# EasyEDA schematic 1-Schematic_Attyni13 EvaBoard.json
TITLE: Attiny13 Prototiping board; REV: 1.3; Date: 2023-11-29; Sheet: 1/1; Company: Lucian Semiconductors
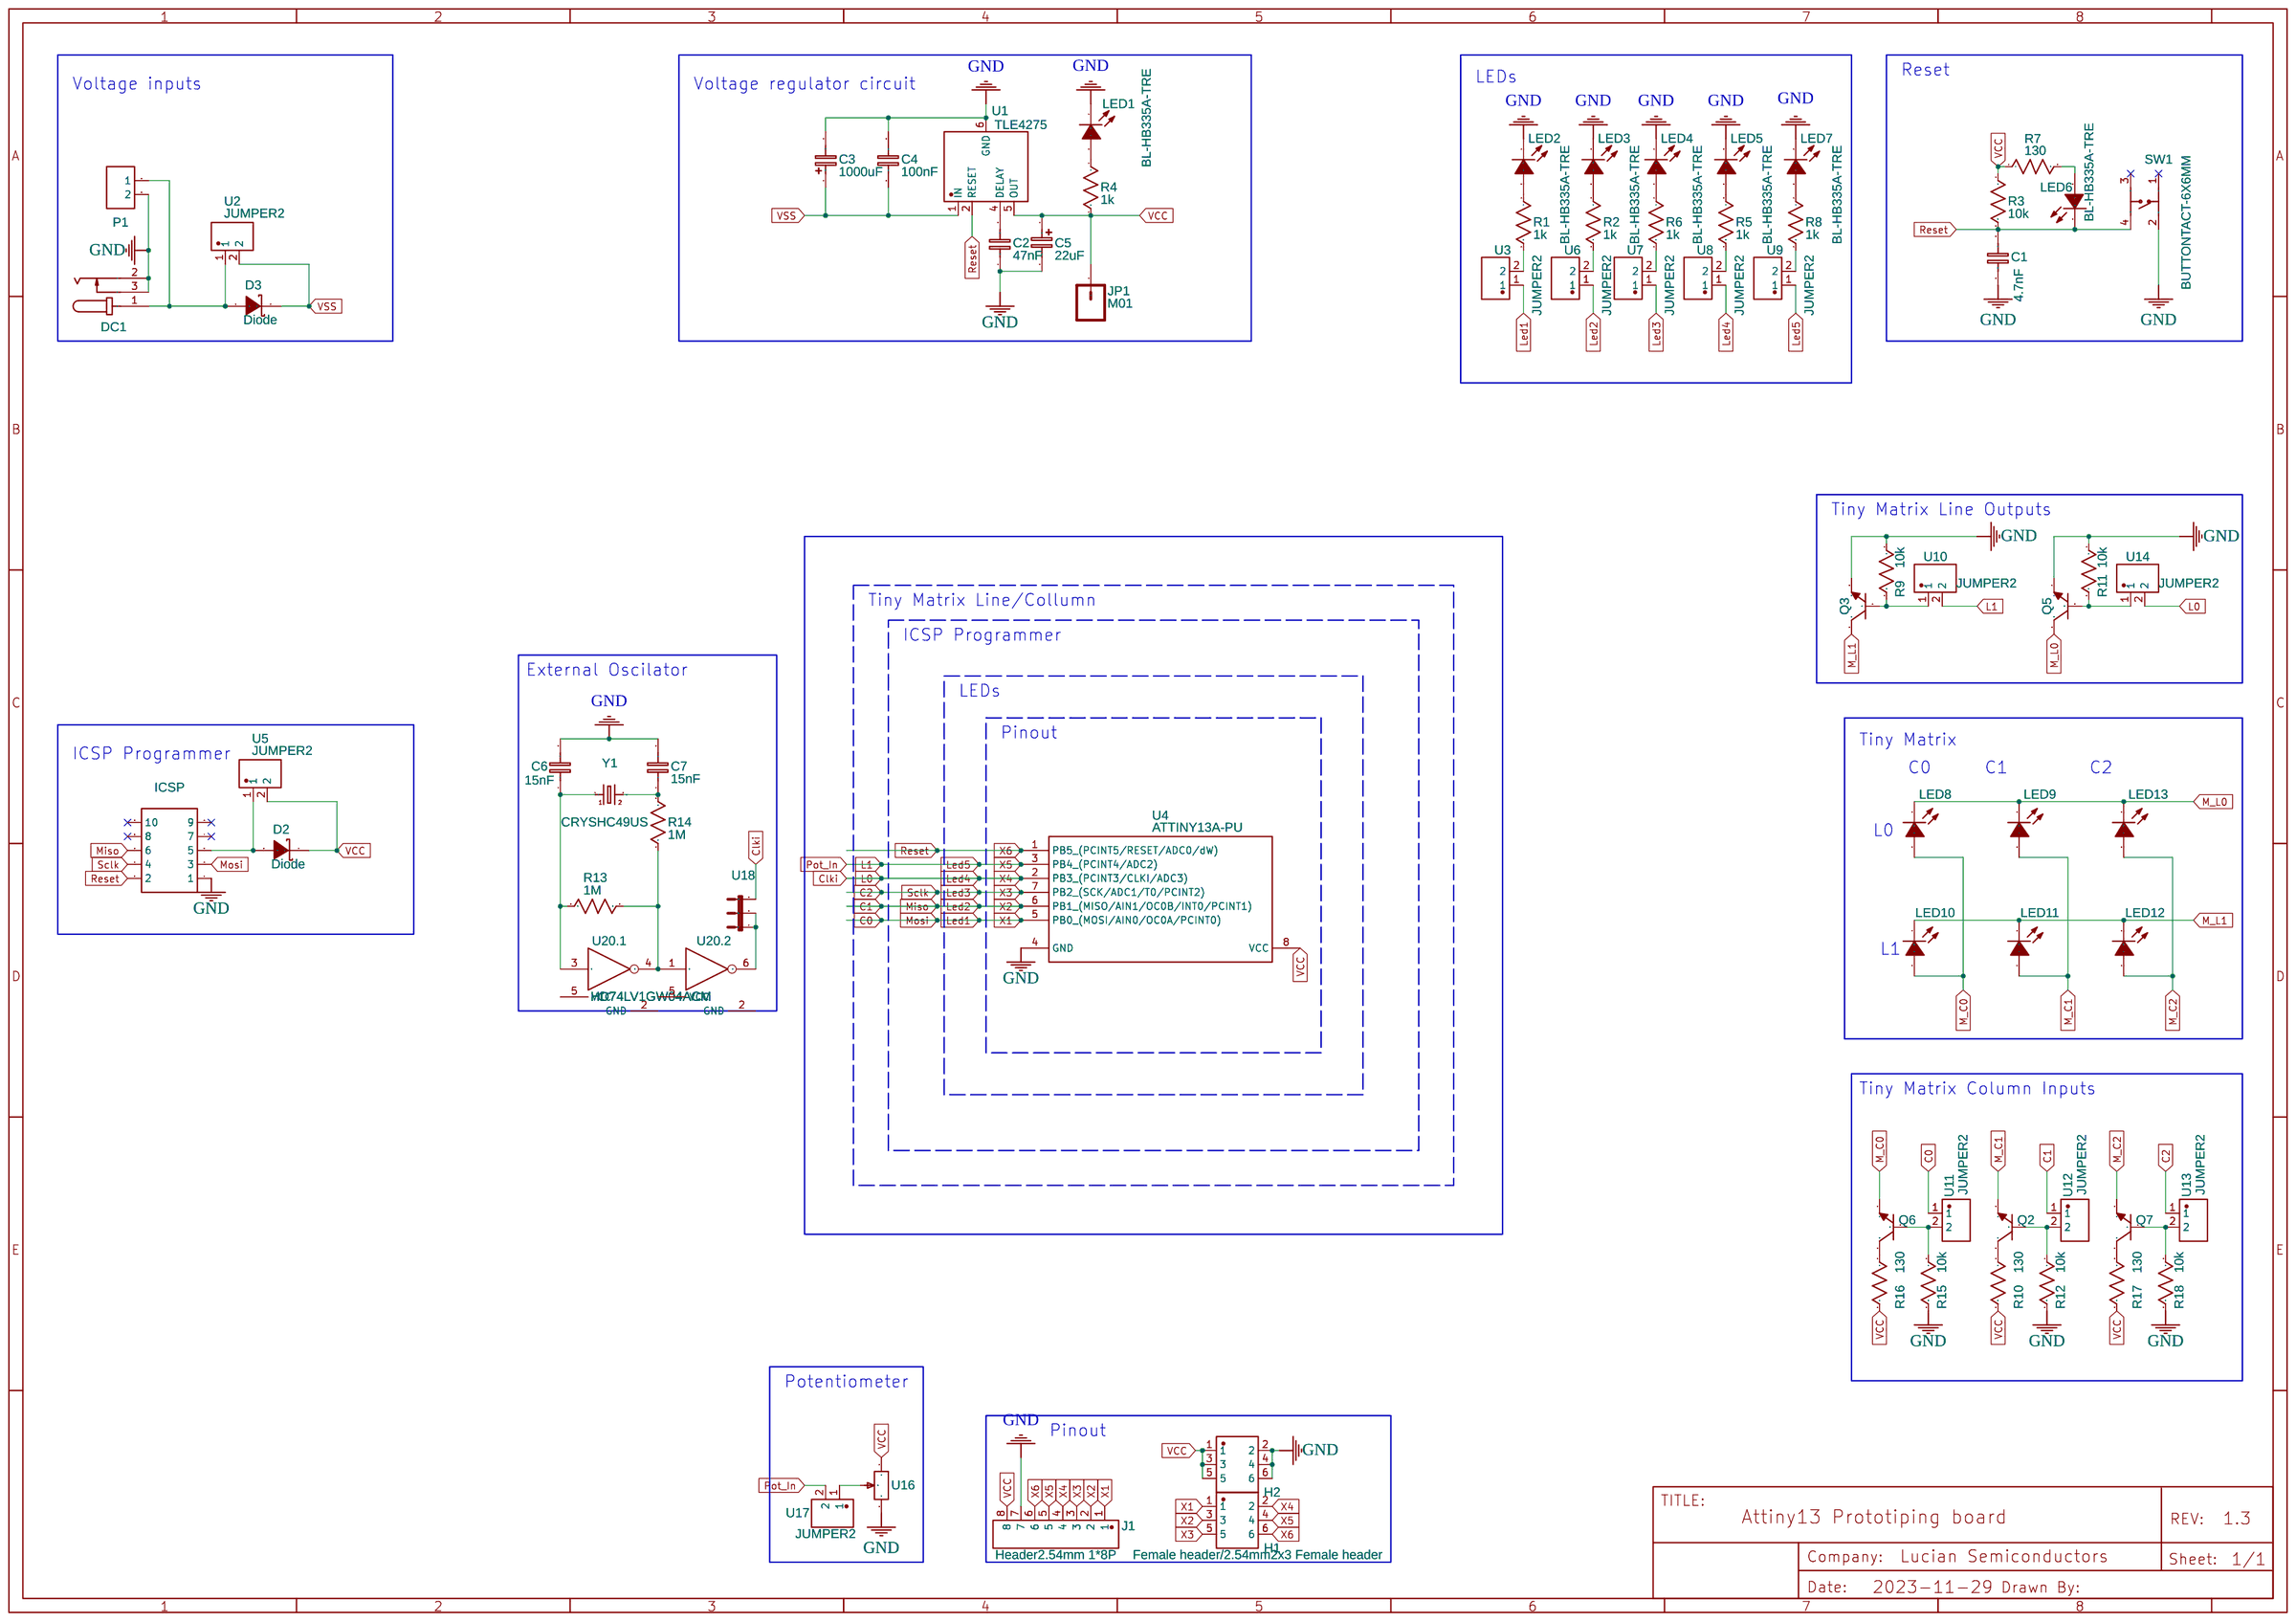
[diagram p0: schematic sheet]

## Parts
C1  4.7nF  [C0603]
C2  47nF  [C0603]
C3  1000uF  [CASE-A_3216]
C4  100nF  [C0603]
C5  22uF  [CASE-A_3216]
C6  15nF  [C0603]
C7  15nF  [C0603]
D2  Diode  [SOD-123FL_L2.6-W1.6-LS3.4-RD]
D3  Diode  [SOD-123FL_L2.6-W1.6-LS3.4-RD]
DC1  DC005-2.0MM  [DC-IN-TH_DC005]
H1  Female header/2.54mm2x3 Female header  [HDR-TH_6P-P2.54-V-F-R2-C3-S2.54]
H2  Female header/2.54mm2x3 Female header  [HDR-TH_6P-P2.54-V-F-R2-C3-S2.54]
ICSP  HDR-IDC-2.54-2X5P  [IDC-TH_10P-P2.54_C5665]
J1  Header2.54mm 1*8P  [HDR-TH_8P-P2.54-V-M]
JP1  M01  [1X01PROBE]
LED1  BL-HB335A-TRE  [LED0805-RD_BRTLED_BL-HB335A-TRE]
LED2  BL-HB335A-TRE  [LED0805-RD_BRTLED_BL-HB335A-TRE]
LED3  BL-HB335A-TRE  [LED0805-RD_BRTLED_BL-HB335A-TRE]
LED4  BL-HB335A-TRE  [LED0805-RD_BRTLED_BL-HB335A-TRE]
LED5  BL-HB335A-TRE  [LED0805-RD_BRTLED_BL-HB335A-TRE]
LED6  BL-HB335A-TRE  [LED0805-RD_BRTLED_BL-HB335A-TRE]
LED7  BL-HB335A-TRE  [LED0805-RD_BRTLED_BL-HB335A-TRE]
LED8  BL-HB335A-TRE  [LED0805-RD_BRTLED_BL-HB335A-TRE]
LED9  BL-HB335A-TRE  [LED0805-RD_BRTLED_BL-HB335A-TRE]
LED10  BL-HB335A-TRE  [LED0805-RD_BRTLED_BL-HB335A-TRE]
LED11  BL-HB335A-TRE  [LED0805-RD_BRTLED_BL-HB335A-TRE]
LED12  BL-HB335A-TRE  [LED0805-RD_BRTLED_BL-HB335A-TRE]
LED13  BL-HB335A-TRE  [LED0805-RD_BRTLED_BL-HB335A-TRE]
P1  CONN-TH_2P-P5.00  [CONN-TH_2P-P5.00]
Q2  2SC2411KT146R  [SOT-346_L2.9-W1.6-P1.90-LS2.8-TR-CW]
Q3  2SC2411KT146R  [SOT-346_L2.9-W1.6-P1.90-LS2.8-TR-CW]
Q5  2SC2411KT146R  [SOT-346_L2.9-W1.6-P1.90-LS2.8-TR-CW]
Q6  2SC2411KT146R  [SOT-346_L2.9-W1.6-P1.90-LS2.8-TR-CW]
Q7  2SC2411KT146R  [SOT-346_L2.9-W1.6-P1.90-LS2.8-TR-CW]
R1  1k  [R0603]
R2  1k  [R0603]
R3  10k  [R0603]
R4  1k  [R0603]
R5  1k  [R0603]
R6  1k  [R0603]
R7  130  [R0603]
R8  1k  [R0603]
R9  10k  [R0603]
R10  130  [R0603]
R11  10k  [R0603]
R12  10k  [R0603]
R13  1M  [R0603]
R14  1M  [R0603]
R15  10k  [R0603]
R16  130  [R0603]
R17  130  [R0603]
R18  10k  [R0603]
SW1  BUTTONTACT-6X6MM  [SW-SMD_4P-L6.0-W6.0-P4.50-LS9.2]
U1  TLE4275  [TO-252-5_L6.5-W6.1-P1.14-LS10.0-BR]
U2  JUMPER2  [HDR-TH_2P-P2.54-V-M-1]
U3  JUMPER2  [HDR-TH_2P-P2.54-V-M-1]
U4  ATTINY13A-PU  [DIP-8_L9.3-W6.4-P2.54-LS7.6-BL-1]
U5  JUMPER2  [HDR-TH_2P-P2.54-V-M-1]
U6  JUMPER2  [HDR-TH_2P-P2.54-V-M-1]
U7  JUMPER2  [HDR-TH_2P-P2.54-V-M-1]
U8  JUMPER2  [HDR-TH_2P-P2.54-V-M-1]
U9  JUMPER2  [HDR-TH_2P-P2.54-V-M-1]
U10  JUMPER2  [HDR-TH_2P-P2.54-V-M-1]
U11  JUMPER2  [HDR-TH_2P-P2.54-V-M-1]
U12  JUMPER2  [HDR-TH_2P-P2.54-V-M-1]
U13  JUMPER2  [HDR-TH_2P-P2.54-V-M-1]
U14  JUMPER2  [HDR-TH_2P-P2.54-V-M-1]
U16  NO  [RES-ADJ_3296W]
U17  JUMPER2  [HDR-TH_2P-P2.54-V-M-1]
U18  NO  [1X03]
U20  HD74LV1GW04ACM  [SOT363]  (sections 1,2)
Y1  CRYSHC49US  [HC49US]

## Library data of the parts
C1 C2 C4 C6 C7 = C_0603_EU: Contributor: LCEDA_Lib
C3 C5 = C_Tan_SMD_A_EU: Contributor: LCEDA_Lib
D2 D3 = DIODE SHOTTKY 30V 2A PMEG3020EH,115: Supplier: LCSC; Supplier Part: C167645; Manufacturer: Nexperia; Manufacturer Part: PMEG3020EH,115; Contributor: LCSC; SMT Type: Extend; JLCPCB SMD: Yes; LCSC Assembly: Yes; Assembly Type: smtWeld; Paste Type: expand
DC1 = DC005-2.0MM: Supplier: LCSC; Manufacturer: SOFNG; Supplier Part: C111567
H1 H2 = Female header/2.54mm2x3 Female header: Supplier Part: C47552; Supplier: LCSC; Manufacturer: ReliaPro; link: https://lcsc.com/eda_search?q=C47552&%26type=1&ref=editor
ICSP = HDR-IDC-2.54-2X5P: Supplier: LCSC; Manufacturer: BOOMELE; Manufacturer Part: IDC Box 2.54mm 2X5P; image: //image.lceda.cn/szlcsc/C5665.jpg; Supplier Part: C5665
J1 = Header2.54mm 1*8P: Supplier Part: C49256; Supplier: LCSC; Manufacturer: ReliaPro; link: https://lcsc.com/eda_search?q=C49256&%26type=1&ref=editor
JP1 = M01: Header 1
LED1-LED13 = BL-HB335A-TRE: Contributor: LCSC; Supplier: LCSC; Supplier Part: C138558; Manufacturer: BrtLed(佰鸿); JLCPCB Part Class: Extended Part; link: https://lcsc.com/eda_search?q=C138558&%26type=1&ref=editor
P1 = CONN-TH_2P-P5.00: Supplier: LCSC; Contributor: LCEDA_Lib
Q2 Q3 Q5-Q7 = 2SC2411KT146R: Contributor: LCSC; Supplier: LCSC; Supplier Part: C122622; Manufacturer: ROHM(罗姆); JLCPCB Part Class: Extended Part; link: https://lcsc.com/eda_search?q=C122622&%26type=1&ref=editor
R1-R18 = R_0603_US: Contributor: LCEDA_Lib
SW1 = BUTTONTACT-6X6MM: Contributor: LCSC; Supplier: LCSC; Supplier Part: C9900004221; Manufacturer Part: Buttontact-6x6mm; JLCPCB Part Class: Extended Part; link: https://lcsc.com/eda_search?q=C9900004221&%26type=1&ref=editor
U1 = TLE4275QKVURQ1: Contributor: LCSC; Supplier: LCSC; Supplier Part: C781809; Manufacturer: TI(德州仪器); JLCPCB Part Class: Extended Part; link: https://lcsc.com/eda_search?q=C781809&%26type=1&ref=editor
U2 U3 U5-U14 U17 = JUMPER2: Contributor: LCSC; Supplier: LCSC; Supplier Part: C2940092; Manufacturer: null; Manufacturer Part: Jumper2; JLCPCB Part Class: Extended Part; link: https://lcsc.com/eda_search?q=C2940092&%26type=1&ref=editor
U4 = ATTINY13A-PU: Contributor: LCSC; Supplier: LCSC; Supplier Part: C94341; Manufacturer: MICROCHIP(美国微芯); JLCPCB Part Class: Extended Part; link: https://lcsc.com/eda_search?q=C94341&%26type=1&ref=editor
U16 = RHOS 3296W-1-103LF: image: http://image.lceda.cn/szlcsc/C5026.jpg; Supplier Part: undefined; Supplier: LCSC; Manufacturer: ReliaPro
U18 = JUMPER-3PTH: Contributor: SparkFun
U20 = HD74LV1GW04ACM: Dual Inverter; subpart_no: 1
Y1 = CRYSTALHC49US: Various standard crystals. Proven footprints.; Contributor: SparkFun

## Nets
GND: C1.1 C2.1 C3.2 C4.2 C5.2 C6.2 C7.2 DC1.2 DC1.3 H2.2 H2.4 H2.6 ICSP.1 J1.7 LED1.1(C) LED2.1(C) LED3.1(C) LED4.1(C) LED5.1(C) LED7.1(C) P1.2 Q3.1(E) Q5.1(E) R9.1 R11.1 R12.2 R15.2 R18.2 SW1.2(B) U1.6(GND) U4.4(GND) U16.3
VCC: C5.1 D2.1(C) H2.1 H2.3 H2.5 J1.8 JP1.1 R3.1 R4.2 R7.1 R10.2 R16.2 R17.2 U1.5(OUT) U4.8(VCC) U5.2 U16.1
VSS: C3.1 C4.1 D3.1(C) U1.1(IN) U2.2
C0: H1.1 ICSP.3 J1.1 U3.1 U4.5(PB0 (MOSI/AIN0/OC0A/PCINT0)) U11.1
C1: H1.3 ICSP.6 J1.2 U4.6(PB1 (MISO/AIN1/OC0B/INT0/PCINT1)) U6.1 U12.1
C2: H1.5 ICSP.4 J1.3 U4.7(PB2 (SCK/ADC1/T0/PCINT2)) U7.1 U13.1
Clki: H1.2 J1.4 U4.2(PB3 (PCINT3/CLKI/ADC3)) U8.1 U14.2 U18.3
L1: H1.4 J1.5 U4.3(PB4 (PCINT4/ADC2)) U9.1 U10.2 U17.2
M_C0: LED8.2(A) LED10.2(A) Q6.1(E)
M_C1: LED9.2(A) LED11.2(A) Q2.1(E)
M_C2: LED12.2(A) LED13.2(A) Q7.1(E)
M_L0: LED8.1(C) LED9.1(C) LED13.1(C) Q5.3(C)
M_L1: LED10.1(C) LED11.1(C) LED12.1(C) Q3.3(C)
Reset: C1.2 H1.6 ICSP.2 J1.6 LED6.1(C) R3.2 SW1.4(D) U1.2(RESET) U4.1(PB5 (PCINT5/RESET/ADC0/dW))
Net-(C2-2): C2.2 U1.4(DELAY)
Net-(C6-1): C6.1 R13.1 U20.3(2A) Y1.1
Net-(C7-1): C7.1 R14.2 Y1.2
Net-(D2-2): D2.2(A) ICSP.5 U5.1
Net-(D3-2): D3.2(A) DC1.1 P1.1 U2.1
Net-(LED1-2): LED1.2(A) R4.1
Net-(LED2-2): LED2.2(A) R1.1
Net-(LED3-2): LED3.2(A) R2.1
Net-(LED4-2): LED4.2(A) R6.1
Net-(LED5-2): LED5.2(A) R5.1
Net-(LED6-2): LED6.2(A) R7.2
Net-(LED7-2): LED7.2(A) R8.1
Net-(Q2-2): Q2.2(B) R12.1 U12.2
Net-(Q2-3): Q2.3(C) R10.1
Net-(Q3-2): Q3.2(B) R9.2 U10.1
Net-(Q5-2): Q5.2(B) R11.2 U14.1
Net-(Q6-2): Q6.2(B) R15.1 U11.2
Net-(Q6-3): Q6.3(C) R16.1
Net-(Q7-2): Q7.2(B) R18.1 U13.2
Net-(Q7-3): Q7.3(C) R17.1
Net-(R1-2): R1.2 U3.2
Net-(R2-2): R2.2 U6.2
Net-(R5-2): R5.2 U8.2
Net-(R6-2): R6.2 U7.2
Net-(R8-2): R8.2 U9.2
Net-(R13-2): R13.2 R14.1 U20.1(1A) U20.4(2Y)
Net-(U16-2): U16.2 U17.1
Net-(U18-1): U18.1 U18.2 U20.6(1Y)

Not connected (* = marked no-connect by the designer): ICSP 7* 8* 9* 10*; SW1 1(A)* 3(C)*; U20 2(GND) 5(VCC)

## Notes on the sheet
- Voltage inputs
- Voltage regulator circuit
- LEDs
- Reset
- Tiny Matrix Line Outputs
- Tiny Matrix Line/Collumn
- ICSP Programmer
- External Oscilator
- LEDs
- Pinout
- Tiny Matrix
- ICSP Programmer
- C0
- C1
- C2
- L0
- L1
- Tiny Matrix Column Inputs
- Potentiometer
- Pinout
